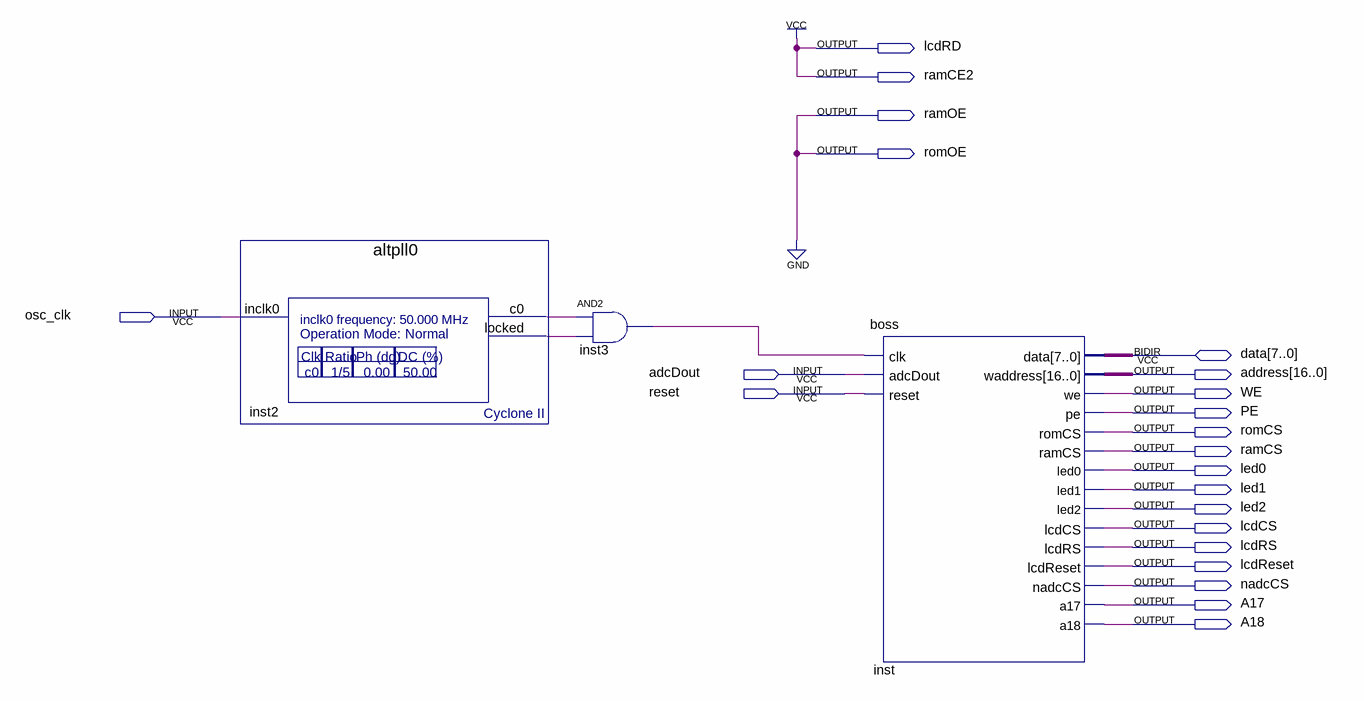
[diagram p0: schematic sheet]
// Quartus schematic ZMachine.bdf as structural Verilog: 3 symbols, 22 pins
module ZMachine (
  input  osc_clk,
  input  adcDout,
  input  reset,
  inout  [7:0] data,
  output lcdRD,
  output ramCE2,
  output ramOE,
  output romOE,
  output [16:0] address,
  output WE,
  output PE,
  output romCS,
  output ramCS,
  output led0,
  output led1,
  output led2,
  output lcdCS,
  output lcdRS,
  output lcdReset,
  output nadcCS,
  output A17,
  output A18
);

  wire inst2_c0, inst2_locked, inst3_out;

  altpll0 inst2 (.inclk0(osc_clk), .c0(inst2_c0), .locked(inst2_locked));
  and inst3 (inst3_out, inst2_c0, inst2_locked);
  boss inst (
    .clk(inst3_out), .adcDout(adcDout), .reset(reset), .waddress(address), .we(WE), .pe(PE), .romCS(romCS),
    .ramCS(ramCS), .led0(led0), .led1(led1), .led2(led2), .lcdCS(lcdCS), .lcdRS(lcdRS), .lcdReset(lcdReset),
    .nadcCS(nadcCS), .a17(A17), .a18(A18), .data(data));

  assign lcdRD = 1'b1;
  assign ramCE2 = 1'b1;
  assign ramOE = 1'b0;
  assign romOE = 1'b0;
endmodule
